# EAGLE design untitled (EAGLE 9.0.0)
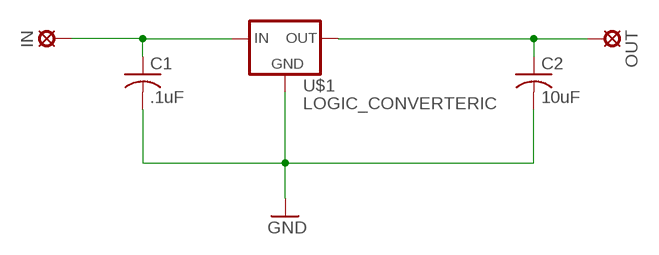
[diagram p0: schematic, sheet 1]

## Parts
C1  .1uF  C-USC0805K  [C0805K]
C2  10uF  C-USC0805K  [C0805K]
IN  LSP10  [LSP10]
OUT  LSP10  [LSP10]
U$1  LOGIC_CONVERTERIC  [SOT223]

## Nets
GND: C1.2 C2.2 U$1.GND
N$2: C1.1 IN.MP U$1.IN
N$3: C2.1 OUT.MP U$1.OUT

## Library data of the parts
C1 C2 = rcl:C-US: CAPACITOR, American symbol; SPICEPREFIX: C
IN OUT = solpad:LSP10: SOLDER PAD drill 1.0 mm, distributor Buerklin, 12H555
U$1 = Modulo conversor:LOGIC_CONVERTER

## Board
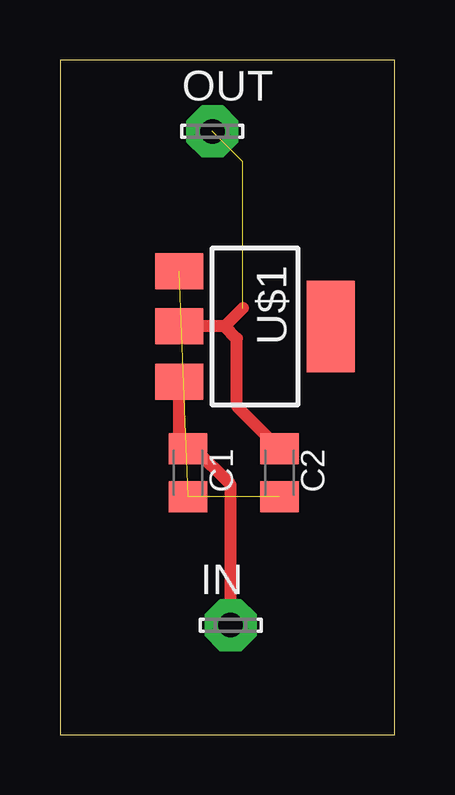
[diagram p1: board, top side]

Size 13.95 x 28.12 mm. Coordinates in mm from the lower left corner, seen from the top.
Outline: 0,0 13.95,0 13.95,28.12 0,28.12 0,0
Copper layers (1*16): Top 0.035mm / dielectric 1.5mm / Bottom 0.035mm
Design rules "default": minimum track width 6mil, minimum drill 0.35mm, track to track 6mil, track to pad 6mil, pad to pad 6mil, via to via 6mil, smd to smd 6mil, copper to edge 40mil, drill to drill 6mil, minimum pad ring 10mil, minimum via ring 8mil, stop-mask expansion 4mil, vias tented up to drill 0mil, thermal gap 10mil

### Footprints (pad centres in the part's own frame; a part is rotated, then mirrored left to right if it is on the bottom)
C0805K = smd 1.3 x 1.6: 1 -1,0; 2 1,0
LSP10 = drill 1.016 pad 2.159 octagon: MP 0,0
SOT223 = smd 3.8 x 2: 4 0,3.15 | smd 1.5 x 2: GND -2.3,-3.15; IN 2.3,-3.15; OUT 0,-3.15

### Placement (x,y rotation side)
C1  5.33,10.92 270 top
C2  9.14,10.92 270 top
IN  7.11,4.57 0 top
OUT  6.35,25.15 0 top
U$1  8.13,17.02 270 top

### Tracks (layer width: path | path; a pad name or v marks a point on that pad's centre or on a via)
GND  (2 unrouted)
  Top 0.508: 4.59,19.32 U$1.GND
N$2
  Top 0.508: IN.MP 7.11,10.41 5.6,11.92 C1.1 4.98,12.28 U$1.IN
N$3  (2 unrouted)
  Top 0.508: C2.1 7.37,13.7 7.37,16.51 6.86,17.02 | 6.86,17.02 U$1.OUT | 6.86,17.02 7.62,17.78